# EAGLE schematic Beeclust_MicroMouse_v1.0 (EAGLE 9.2.2)
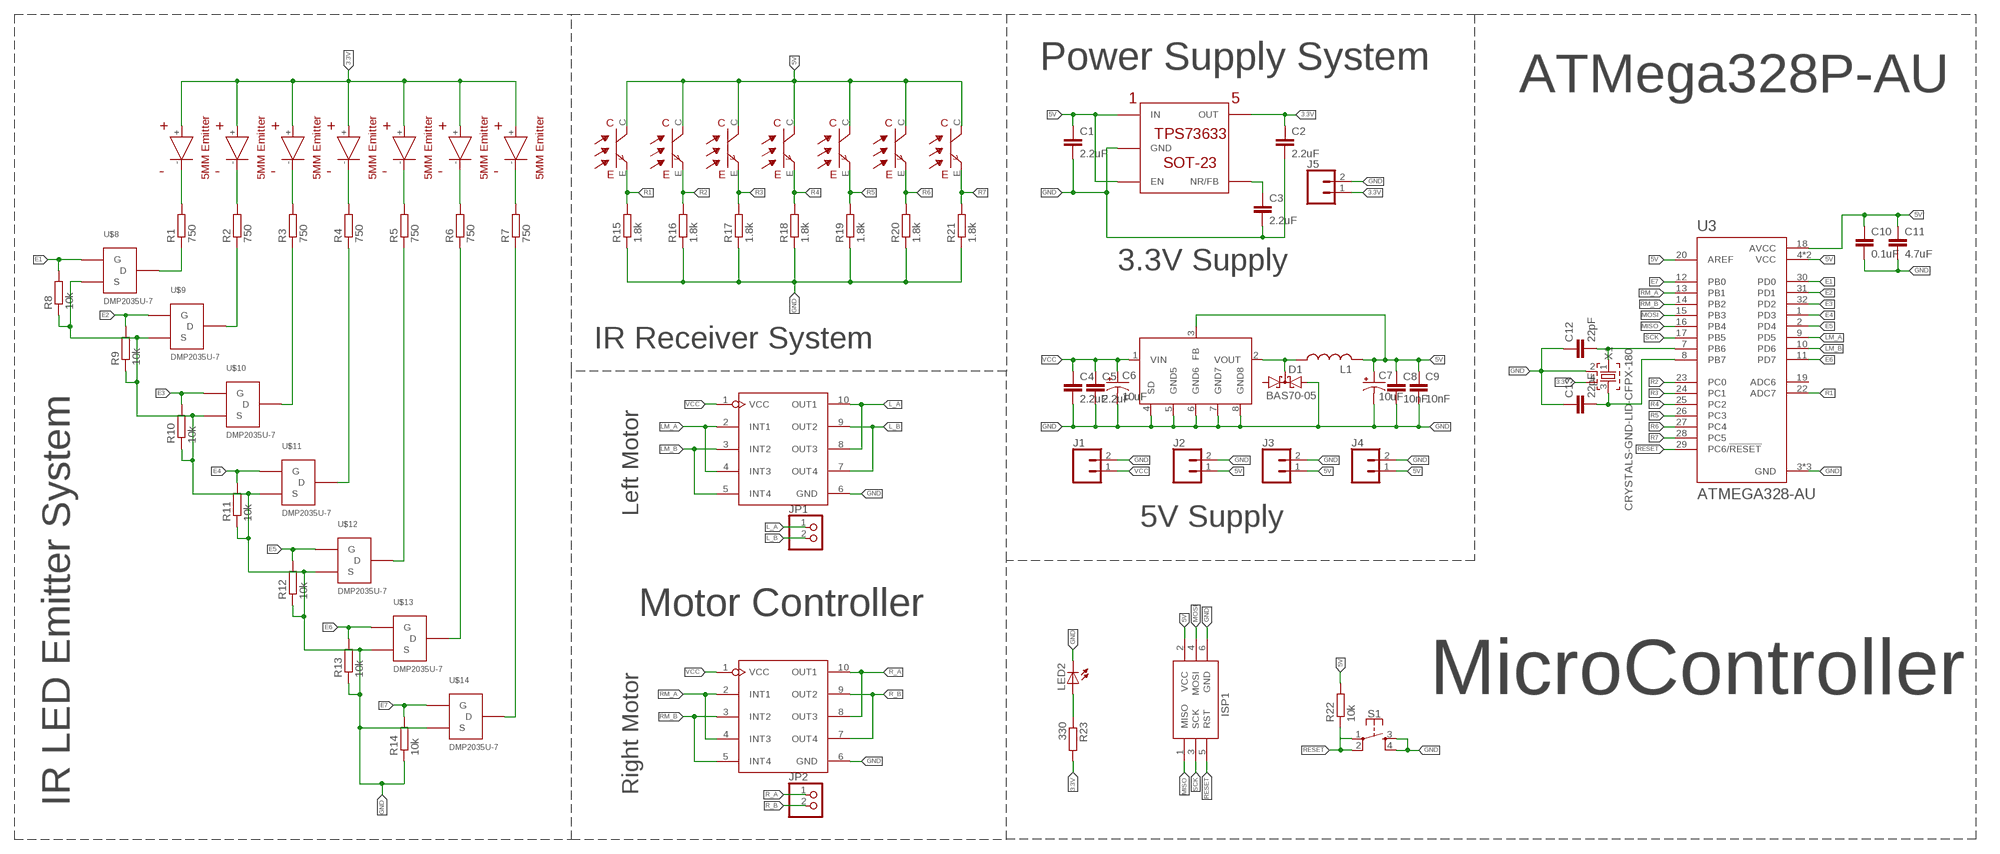
[diagram p0: schematic, sheet 1, part 1 of 2]
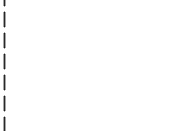
[diagram p1: schematic, sheet 1, part 2 of 2]

## Parts
C1  2.2uF  2.2UF-0603-10V-20%  [0603]
C2  2.2uF  2.2UF-0603-10V-20%  [0603]
C3  2.2uF  2.2UF-0603-10V-20%  [0603]
C4  2.2uF  2.2UF-0603-10V-20%  [0603]
C5  2.2uF  2.2UF-0603-10V-20%  [0603]
C6  10uF  10UF-POLAR-0603-6.3V-20%(TANT)  [0603-POLAR]
C7  10uF  10UF-POLAR-0603-6.3V-20%(TANT)  [0603-POLAR]
C8  10nF  10NF-0603-50V-10%  [0603]
C9  10nF  10NF-0603-50V-10%  [0603]
C10  0.1uF  0.1UF-0603-25V-(+80/-20%)  [0603]
C11  4.7uF  4.7UF0603  [0603]
C12  22pF  22PF-0603-50V-5%  [0603]
C13  22pF  22PF-0603-50V-5%  [0603]
D1  BAS70-05  [SOT23]
ISP1  AVRISP-6  [AVRISP]
J1  CONN_02PTH3  [1X02_LONGPADS]
J2  CONN_02PTH3  [1X02_LONGPADS]
J3  CONN_02PTH3  [1X02_LONGPADS]
J4  CONN_02PTH3  [1X02_LONGPADS]
J5  CONN_02PTH3  [1X02_LONGPADS]
JP1  PINHD-1X2  [1X02]
JP2  PINHD-1X2  [1X02]
L1  L-USL0201  [L0201]
LED2  LEDCHIP-LED0603  [CHIP-LED0603]
R1  750  R-EU_R0603  [R0603]
R2  750  R-EU_R0603  [R0603]
R3  750  R-EU_R0603  [R0603]
R4  750  R-EU_R0603  [R0603]
R5  750  R-EU_R0603  [R0603]
R6  750  R-EU_R0603  [R0603]
R7  750  R-EU_R0603  [R0603]
R8  10k  R-EU_R0603  [R0603]
R9  10k  R-EU_R0603  [R0603]
R10  10k  R-EU_R0603  [R0603]
R11  10k  R-EU_R0603  [R0603]
R12  10k  R-EU_R0603  [R0603]
R13  10k  R-EU_R0603  [R0603]
R14  10k  R-EU_R0603  [R0603]
R15  1.8k  R-EU_R0603  [R0603]
R16  1.8k  R-EU_R0603  [R0603]
R17  1.8k  R-EU_R0603  [R0603]
R18  1.8k  R-EU_R0603  [R0603]
R19  1.8k  R-EU_R0603  [R0603]
R20  1.8k  R-EU_R0603  [R0603]
R21  1.8k  R-EU_R0603  [R0603]
R22  10k  R-EU_R0603  [R0603]
R23  330  R-EU_R0603  [R0603]
S1  MOMENTARY-SWITCH-SPST-2-SMD-5.2MM  [TACTILE_SWITCH_SMD_5.2MM]
U1  DRIVER-LV8548MC-AH(SOIC10)  [SOIC10-1.0-5X4MM]
U2  DRIVER-LV8548MC-AH(SOIC10)  [SOIC10-1.0-5X4MM]
U3  ATMEGA328-AU  [QFP80P900X900X120-32N]
U$1  EMITTER  [EMITTER]
U$2  EMITTER  [EMITTER]
U$3  EMITTER  [EMITTER]
U$4  EMITTER  [EMITTER]
U$5  EMITTER  [EMITTER]
U$6  EMITTER  [EMITTER]
U$7  EMITTER  [EMITTER]
U$8  DMP2035U-7  [SOT23]
U$9  DMP2035U-7  [SOT23]
U$10  DMP2035U-7  [SOT23]
U$11  DMP2035U-7  [SOT23]
U$12  DMP2035U-7  [SOT23]
U$13  DMP2035U-7  [SOT23]
U$14  DMP2035U-7  [SOT23]
U$15  RECEIVER  [RECEIVER]
U$16  RECEIVER  [RECEIVER]
U$17  RECEIVER  [RECEIVER]
U$18  RECEIVER  [RECEIVER]
U$19  RECEIVER  [RECEIVER]
U$20  RECEIVER  [RECEIVER]
U$21  RECEIVER  [RECEIVER]
U$22  TPS73633(SOT-23)  [TPS73633(SOT-23)]
U$23  AP1509-50SG-13  [SO08]
X1  CRYSTALS-GND-LID-CFPX-180  [3.4X2.7-4-PAD]

## Nets
3.3V: C2.1 J5.1 R23.2 U$1.+ U$2.+ U$3.+ U$4.+ U$5.+ U$6.+ U$7.+ U$22.OUT X1.4
5V: C1.1 C7.+ C8.1 C9.1 C10.1 C11.1 ISP1.2(VCC) J2.1 J3.1 J4.1 L1.2 R22.2 U3.4(VCC) U3.6(VCC) U3.18(AVCC) U3.20(AREF) U$15.C U$16.C U$17.C U$18.C U$19.C U$20.C U$21.C U$22.EN U$22.IN U$23.3(FB)
E1: R8.2 U3.30(PD0) U$8.1(G)
E2: R9.2 U3.31(PD1) U$9.1(G)
E3: R10.2 U3.32(PD2) U$10.1(G)
E4: R11.2 U3.1(PD3) U$11.1(G)
E5: R12.2 U3.2(PD4) U$12.1(G)
E6: R13.2 U3.11(PD7) U$13.1(G)
E7: R14.2 U3.12(PB0) U$14.1(G)
GND: C1.2 C2.2 C3.2 C4.2 C5.2 C6.- C7.- C8.2 C9.2 C10.2 C11.2 C12.1 C13.1 D1.2(A2) ISP1.6(GND) J1.2 J2.2 J3.2 J4.2 J5.2 LED2.C R8.1 R9.1 R10.1 R11.1 R12.1 R13.1 R14.1 R15.1 R16.1 R17.1 R18.1 R19.1 R20.1 R21.1 S1.3 S1.4 U1.6(GND) U2.6(GND) U3.3(GND) U3.5(GND) U3.21(GND) U$8.2(S) U$9.2(S) U$10.2(S) U$11.2(S) U$12.2(S) U$13.2(S) U$14.2(S) U$22.GND U$23.4(SD) U$23.5(GND5) U$23.6(GND6) U$23.7(GND7) U$23.8(GND8) X1.2
L_A: JP1.1 U1.8(OUT3) U1.10(OUT1)
L_B: JP1.2 U1.7(OUT4) U1.9(OUT2)
LM_A: U1.2(INT1) U1.4(INT3) U3.9(PD5)
LM_B: U1.3(INT2) U1.5(INT4) U3.10(PD6)
MISO: ISP1.1(MISO) U3.16(PB4)
MOSI: ISP1.4(MOSI) U3.15(PB3)
N$1: R1.2 U$1.-
N$2: R2.2 U$2.-
N$3: R3.2 U$3.-
N$4: R4.2 U$4.-
N$5: R5.2 U$5.-
N$6: R6.2 U$6.-
N$7: R7.2 U$7.-
N$8: R1.1 U$8.3(D)
N$9: R2.1 U$9.3(D)
N$10: R3.1 U$10.3(D)
N$11: R4.1 U$11.3(D)
N$12: R5.1 U$12.3(D)
N$13: R6.1 U$13.3(D)
N$14: R7.1 U$14.3(D)
N$15: D1.3(C) L1.1 U$23.2(VOUT)
N$16: C12.2 U3.7(PB6) X1.1
N$17: C3.1 U$22.NR/FB
N$18: C13.2 U3.8(PB7) X1.3
N$21: LED2.A R23.1
R1: R15.2 U3.22(ADC7) U$15.E
R2: R16.2 U3.23(PC0) U$16.E
R3: R17.2 U3.24(PC1) U$17.E
R4: R18.2 U3.25(PC2) U$18.E
R5: R19.2 U3.26(PC3) U$19.E
R6: R20.2 U3.27(PC4) U$20.E
R7: R21.2 U3.28(PC5) U$21.E
R_A: JP2.1 U2.8(OUT3) U2.10(OUT1)
R_B: JP2.2 U2.7(OUT4) U2.9(OUT2)
RESET: ISP1.5(RST) R22.1 S1.1 S1.2 U3.29(PC6/!RESET)
RM_A: U2.2(INT1) U2.4(INT3) U3.13(PB1)
RM_B: U2.3(INT2) U2.5(INT4) U3.14(PB2)
SCK: ISP1.3(SCK) U3.17(PB5)
VCC: C4.1 C5.1 C6.+ J1.1 U1.1(VCC) U2.1(VCC) U$23.1(VIN)
Unconnected: D1.1(A1) U3.19(ADC6)

## Notes on the sheet
- Power Supply System
- ATMega328P-AU
- 3.3V Supply
- IR Receiver System
- Left Motor
- 5V Supply
- Motor Controller
- MicroController
- Right Motor
- IR LED Emitter System

## Library data of the parts
C1-C5 = SparkFun-Capacitors:2.2UF: 2.2µF ceramic capacitors A capacitor is a passive two-terminal electrical component used to store electrical energy temporarily in an electric field.; PROD_ID: CAP-07888
C6 C7 = SparkFun-Capacitors:10UF-POLAR: 10.0µF polarized capacitors A capacitor is a passive two-terminal electrical component used to store electrical energy temporarily in an electric field.; PROD_ID: CAP-13210
C8 C9 = SparkFun-Capacitors:10NF: 0.01uF/10nF/10,000pF ceramic capacitors A capacitor is a passive two-terminal electrical component used to store electrical energy temporarily in an electric field. CAP-09321; PROD_ID: CAP-00867
C10 = SparkFun-Capacitors:0.1UF: 0.1µF ceramic capacitors A capacitor is a passive two-terminal electrical component used to store electrical energy temporarily in an electric field.; PROD_ID: CAP-00810
C11 = SparkFun-Capacitors:4.7UF: 4.7µF ceramic capacitors A capacitor is a passive two-terminal electrical component used to store electrical energy temporarily in an electric field.; PROD_ID: CAP-08280
C12 C13 = SparkFun-Capacitors:22PF: 22pF ceramic capacitors A capacitor is a passive two-terminal electrical component used to store electrical energy temporarily in an electric field.; PROD_ID: CAP-07876
D1 = diode:BAS70-05: Silicon Schottky Diodes General-purpose diode for high-speed switching
ISP1 = adafruit:AVRISP: AVR ISP HEADER Standard 6 pin header for AVR programming
J1-J5 = SparkFun-Connectors:CONN_02: Multi connection point. Often used as Generic Header-pin footprint for 0.1 inch spaced/style header connections On any of the 0.1 inch spaced packages, you can populate with these: Break Away Headers - Straight <https://www.sparkfun.com/products/116> (PRT-00116) Break Away Male Headers - Right Angle <https://www.sparkfun.com/products/553> (PRT-00553) Female Headers <https://www.sparkfun.com/products/115> (PRT-00115) Break Away Headers - Machine Pin <https://www.sparkfun.com/products/117> (PRT-00117) Break Away Female Headers - Swiss Machine Pin <https://www.sparkfun.com/products/743> (PRT-00743) For SCREWTERMINALS and SPRING TERMINALS visit here: Screw Terimnals on SparkFun.com <https://www.sparkfun.com/search/results?term=Screw+Terminals> (5mm/3.5mm/2.54mm spacing) This device is also useful as a general connection point to wire up your design to another part of your project. Our various solder wires solder well into these plated through hole pads. Hook-Up Wire - Assortment (Stranded, 22 AWG) <https://www.sparkfun.com/products/11375> (PRT-11375) Hook-Up Wire - Assortment (Solid Core, 22 AWG) <https://www.sparkfun.com/products/11367> (PRT-11367) View the entire wire category on our website here <https://www.sparkfun.com/categories/141> Special notes: Molex polarized connector foot print use with: PRT-08233 with associated crimp pins and housings. 2.54_SCREWTERM for use with PRT-10571. 3.5mm Screw Terminal footprints for PRT-08084 5mm Screw Terminal footprints for use with PRT-08432
JP1 JP2 = pinhead:PINHD-1X2: PIN HEADER
L1 = rcl:L-US: INDUCTOR, American symbol; SPICEPREFIX: L
LED2 = adafruit:LED: LED OSRAM: - CHIPLED LG R971, LG N971, LY N971, LG Q971, LY Q971, LO R971, LY R971 LH N974, LH R974 LS Q976, LO Q976, LY Q976 LO Q996 - Hyper CHIPLED LW Q18S LB Q993, LB Q99A, LB R99A - SideLED LS A670, LO A670, LY A670, LG A670, LP A670 LB A673, LV A673, LT A673, LW A673 LH A674 LY A675 LS A676, LA A676, LO A676, LY A676, LW A676 LS A679, LY A679, LG A679 - Hyper Micro SIDELED® LS Y876, LA Y876, LO Y876, LY Y876 LT Y87S - SmartLED LW L88C, LW L88S LB L89C, LB L89S, LG L890 LS L89K, LO L89K, LY L89K LS L896, LA L896, LO L896, LY L896 - TOPLED LS T670, LO T670, LY T670, LG T670, LP T670 LSG T670, LSP T670, LSY T670, LOP T670, LYG T670 LG T671, LOG T671, LSG T671 LB T673, LV T673, LT T673, LW T673 LH T674 LS T676, LA T676, LO T676, LY T676, LB T676, LH T676, LSB T676, LW T676 LB T67C, LV T67C, LT T67C, LS T67K, LO T67K, LY T67K, LW E67C LS E67B, LA E67B, LO E67B, LY E67B, LB E67C, LV E67C, LT E67C LW T67C LS T679, LY T679, LG T679 LS T770, LO T770, LY T770, LG T770, LP T770 LB T773, LV T773, LT T773, LW T773 LH T774 LS E675, LA E675, LY E675, LS T675 LS T776, LA T776, LO T776, LY T776, LB T776 LHGB T686 LT T68C, LB T68C - Hyper Mini TOPLED® LB M676 - Mini TOPLED Santana® LG M470 LS M47K, LO M47K, LY M47K Source: http://www.osram.convergy.de/
R1-R23 = rcl:R-EU_: RESISTOR, European symbol; SPICEPREFIX: R
S1 = SparkFun-Switches:MOMENTARY-SWITCH-SPST-2: Momentary Switch (Pushbutton) - SPST - Two Circuits Normally-open (NO) SPST momentary switches (buttons, pushbuttons). Schematic symbol includes two switch circuits. Variants SMD-4.6MMX2.8MM - 4.60mm x 2.80mm Tactile Momentary Button Switch - Used on SparkFun SAMD21 Mini Breakout <https://www.sparkfun.com/products/13664> SMD-5.2MM - Mini Pushbutton Switch - SMD <https://www.sparkfun.com/products/8720> - Used on Arduino Pro Mini <https://www.sparkfun.com/products/11114>; PROD_ID: SWCH-08247; SF_SKU: COM-08720
U1 U2 = LV8548MC-AH_SOIC10_:DRIVER-LV8548MC-AH(SOIC10): 310030259; AVAILABILITY: Unavailable; DESCRIPTION: LV8548MC Series 16 V 1 A 1 W Dual Ch Forward/Reverse Motor Driver - MFP-10S; MF: ON Semiconductor; MP: LV8548MC-AH; PACKAGE: SOIC-10 ON Semiconductor; PRICE: None
U3 = ATMEGA328-AU:ATMEGA328-AU: ATmega Series 20 MHz 32 KB Flash 2 KB SRAM 8-Bit Microcontroller - TQFP-32; AVAILABILITY: Unavailable; DESCRIPTION: ATmega Series 20 MHz 32 KB Flash 2 KB SRAM 8-Bit Microcontroller - TQFP-32; MF: Microchip; MP: ATMEGA328-AU; PACKAGE: TQFP-32 Microchip; PRICE: None
U$1-U$7 = sfh4550 & teft4300:EMITTER
U$8-U$14 = DMP2035U-7:DMP2035U-7: Diodes Inc. DMP2035U-7-7 P-channel logic level mosfet; AVAILABILITY: Unavailable; DESCRIPTION: DMP2035U Series 20 V 35 mOhm P-Channel Enhancement Mode Mosfet - SOT-23-3; MF: Diodes Inc.; MP: DMP2035U-7; PACKAGE: SOT-23-3 Diodes Inc.; PRICE: None
U$15-U$21 = sfh4550 & teft4300:RECEIVER
U$22 = TPS73633(SOT-23):TPS73633(SOT-23)
U$23 = AP1509-50SG-13:AP1509-50SG-13; AVAILABILITY: Unavailable; DESCRIPTION: Voltage Regulators - Switching SW REG CNV BUCK ASYN 150K 1.4 22V 5.0V; MF: Diodes Inc.; MP: AP1509-50SG-13; PACKAGE: SOP-8 Diodes Inc.; PRICE: None
X1 = IQD-Frequency-Products:CRYSTALS-GND-LID: CRYSTALS WITH CAN GROUNDED